# Altium schematic sheet Mainboard_2.SchDoc
size A4; SheetNumber: 2; SheetTotal: 3
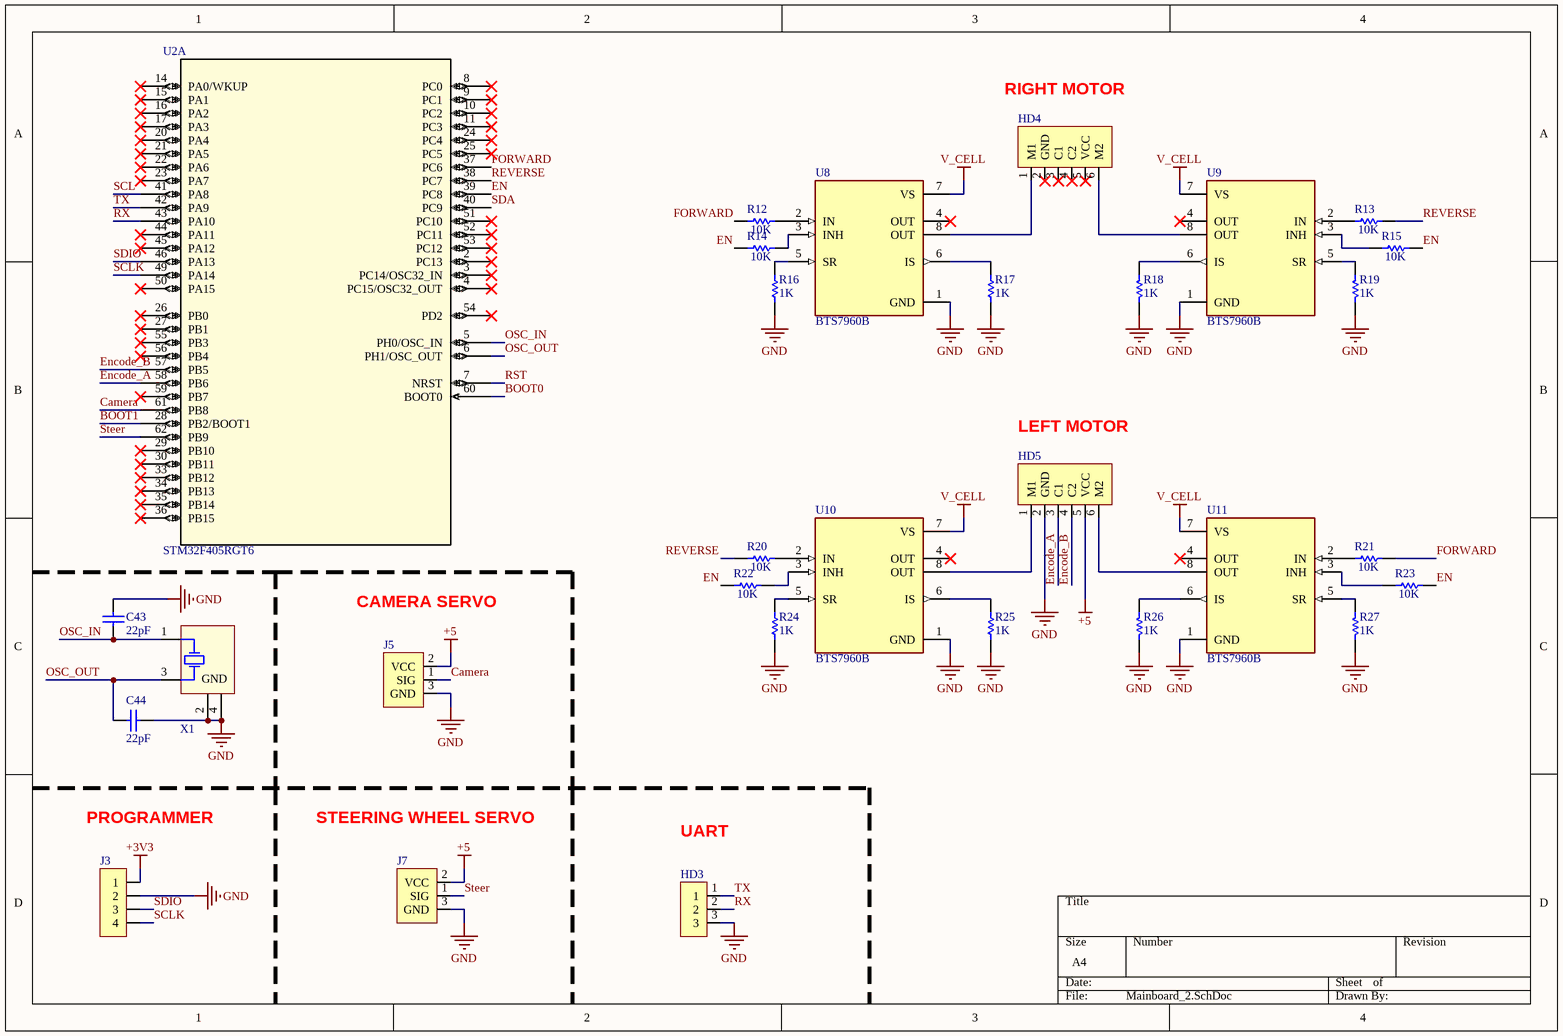
[diagram p0: Mainboard_2.SchDoc]

## Parts
C43  22pF  [6-0805_M]
C44  22pF  [6-0805_M]
HD3  3_pin conn  [3-pin XHB_2.54]  (value not drawn)
HD4  6-pin connnector (Encoder DC motor 2mm)  [6_PIN MOTOR]  (value not drawn)
HD5  6-pin connnector (Encoder DC motor 2mm)  [6_PIN MOTOR]  (value not drawn)
J3  4_pin connector  [4_PIN 2.54mm]  (value not drawn)
J5  3_pin steering wheel  [3_PIN SERVO CONNECTOR]  (value not drawn)
J7  3_pin steering wheel  [3_PIN SERVO CONNECTOR]  (value not drawn)
R12  10K  [6-0805_N]
R13  10K  [6-0805_N]
R14  10K  [6-0805_N]
R15  10K  [6-0805_N]
R16  1K  [6-0805_N]
R17  1K  [6-0805_N]
R18  1K  [6-0805_N]
R19  1K  [6-0805_N]
R20  10K  [6-0805_N]
R21  10K  [6-0805_N]
R22  10K  [6-0805_N]
R23  10K  [6-0805_N]
R24  1K  [6-0805_N]
R25  1K  [6-0805_N]
R26  1K  [6-0805_N]
R27  1K  [6-0805_N]
U2  STM32F405RGT6  [LQFP64-10x10mm]  (part A of 2)
U8  BTS7960B  [DPAK127P1490X440-8N]
U9  BTS7960B  [DPAK127P1490X440-8N]
U10  BTS7960B  [DPAK127P1490X440-8N]
U11  BTS7960B  [DPAK127P1490X440-8N]
X1  XT4  [XT4-SMD]  (value not drawn)

## Nets
+3V3: J3.1
+5: HD5.5(VCC) J5.2(VCC) J7.2(VCC)
GND: C43.1 C44.2 HD3.3 HD5.2(GND) J3.2 J5.3(GND) J7.3(GND) R16.2 R17.2 R18.2 R19.2 R24.2 R25.2 R26.2 R27.2 U8.1(GND) U9.1(GND) U10.1(GND) U11.1(GND) X1.2(GND) X1.4(GND)
V_CELL: U8.7(VS) U9.7(VS) U10.7(VS) U11.7(VS)
BOOT0: U2.60(BOOT0)
BOOT1: U2.28(PB2/BOOT1)
Camera: J5.1(SIG) U2.61(PB8)
EN: R14.1 R15.2 R22.1 R23.2 U2.39(PC8)
Encode_A: HD5.3(C1) U2.58(PB6)
Encode_B: HD5.4(C2) U2.57(PB5)
FORWARD: R12.1 R21.2 U2.37(PC6)
OSC_IN: C43.2 U2.5(PH0/OSC_IN) X1.1(XTAL)
OSC_OUT: C44.1 U2.6(PH1/OSC_OUT) X1.3(XTAL)
REVERSE: R13.2 R20.1 U2.38(PC7)
RST: U2.7(NRST)
RX: HD3.2 U2.43(PA10)
SCL: U2.41(PA8)
SCLK: J3.4 U2.49(PA14)
SDA: U2.40(PC9)
SDIO: J3.3 U2.46(PA13)
Steer: J7.1(SIG) U2.62(PB9)
TX: HD3.1 U2.42(PA9)
NetHD4_1: HD4.1(M1) U8.8(OUT)
NetHD4_6: HD4.6(M2) U9.8(OUT)
NetHD5_1: HD5.1(M1) U10.8(OUT)
NetHD5_6: HD5.6(M2) U11.8(OUT)
NetR12_2: R12.2 U8.2(IN)
NetR13_1: R13.1 U9.2(IN)
NetR14_2: R14.2 U8.3(INH)
NetR15_1: R15.1 U9.3(INH)
NetR16_1: R16.1 U8.5(SR)
NetR17_1: R17.1 U8.6(IS)
NetR18_1: R18.1 U9.6(IS)
NetR19_1: R19.1 U9.5(SR)
NetR20_2: R20.2 U10.2(IN)
NetR21_1: R21.1 U11.2(IN)
NetR22_2: R22.2 U10.3(INH)
NetR23_1: R23.1 U11.3(INH)
NetR24_1: R24.1 U10.5(SR)
NetR25_1: R25.1 U10.6(IS)
NetR26_1: R26.1 U11.6(IS)
NetR27_1: R27.1 U11.5(SR)

Not connected (* = marked no-connect by the designer): HD4 2(GND)* 3(C1)* 4(C2)* 5(VCC)*; U2 2(PC13)* 3(PC14/OSC32_IN)* 4(PC15/OSC32_OUT)* 8(PC0)* 9(PC1)* 10(PC2)* 11(PC3)* 14(PA0/WKUP)* 15(PA1)* 16(PA2)* 17(PA3)* 20(PA4)* 21(PA5)* 22(PA6)* 23(PA7)* 24(PC4)* 25(PC5)* 26(PB0)* 27(PB1)* 29(PB10)* 30(PB11)* 33(PB12)* 34(PB13)* 35(PB14)* 36(PB15)* 44(PA11)* 45(PA12)* 50(PA15)* 51(PC10)* 52(PC11)* 53(PC12)* 54(PD2)* 55(PB3)* 56(PB4)* 59(PB7)*; U8 4(OUT)*; U9 4(OUT)*; U10 4(OUT)*; U11 4(OUT)*

## Notes on the sheet
- RIGHT MOTOR
- LEFT MOTOR
- CAMERA SERVO
- PROGRAMMER
- STEERING WHEEL SERVO
- UART

## Library data of the parts
C43 C44 = Cap: Capacitor; Published: 8-Jun-2000; LatestRevisionDate: 17-Jul-2002; LatestRevisionNote: Re-released for DXP Platform.; PackageReference: RAD-0.3; Publisher: Altium Limited; PackageDescription: Radial Cap, Thru-Hole; 2 Leads; 0.3 in Pin Spacing
HD4 HD5 = 6-pin connnector (Encoder DC motor 2.54mm)
R12-R15 R20-R23 = Res1: Resistor; Published: 8-Jun-2000; LatestRevisionDate: 17-Jul-2002; LatestRevisionNote: Re-released for DXP Platform.; PackageReference: AXIAL-0.3; Publisher: Altium Limited; PackageDescription: Axial Device, Thru-Hole; 2 Leads; 0.3 in Pin Spacing; Value: 10K
R16-R19 R24-R27 = Res1: Resistor; Value: 10K; Published: 8-Jun-2000; LatestRevisionDate: 17-Jul-2002; LatestRevisionNote: Re-released for DXP Platform.; PackageReference: AXIAL-0.3; Publisher: Altium Limited; PackageDescription: Axial Device, Thru-Hole; 2 Leads; 0.3 in Pin Spacing
U2 = STM32F405RGT6: High-performance foundation line, Arm Cortex-M4 core with DSP and FPU, 1 Mbyte of Flash memory, 168 MHz CPU, ART Accelerator; Manufacturer_Name: STMicroelectronics; Copyright: Copyright (C) 2025 Ultra Librarian. All rights reserved.; Manufacturer_Part_Number: STM32F405RGT6; Datasheet: https://www.st.com/resource/en/datasheet/stm32f405rg.pdf; RefDes: RefDes; Type: Type
U8-U11 = BTS7960B: Half Bridge Driver DC Motors, General Purpose DMOS PG-TO263-7-1; MF: Infineon; SnapEDA_Link: https://www.snapeda.com/parts/BTS7960B/Infineon/view-part/?ref=snap; Package: TO-263 Infineon; Value: *; MP: BTS7960B; Check_prices: https://www.snapeda.com/parts/BTS7960B/Infineon/view-part/?ref=eda
X1 = XT4: Crystal, 16 MHz, -30 to 85 degC, 3.2 x 2.5 x 0.9 mm SMD; Value: 4Mhz